# EasyEDA Pro project 二版平衡车pcb.epro, schematic Schematic1
Create Date: 2024-06-18; Page Name: P1; Project Name: 平衡车; Schematic Name: Schematic1; Update Date: 2024-07-03; Company: 嘉立创EDA; Page Size: A4; Version: V1.0
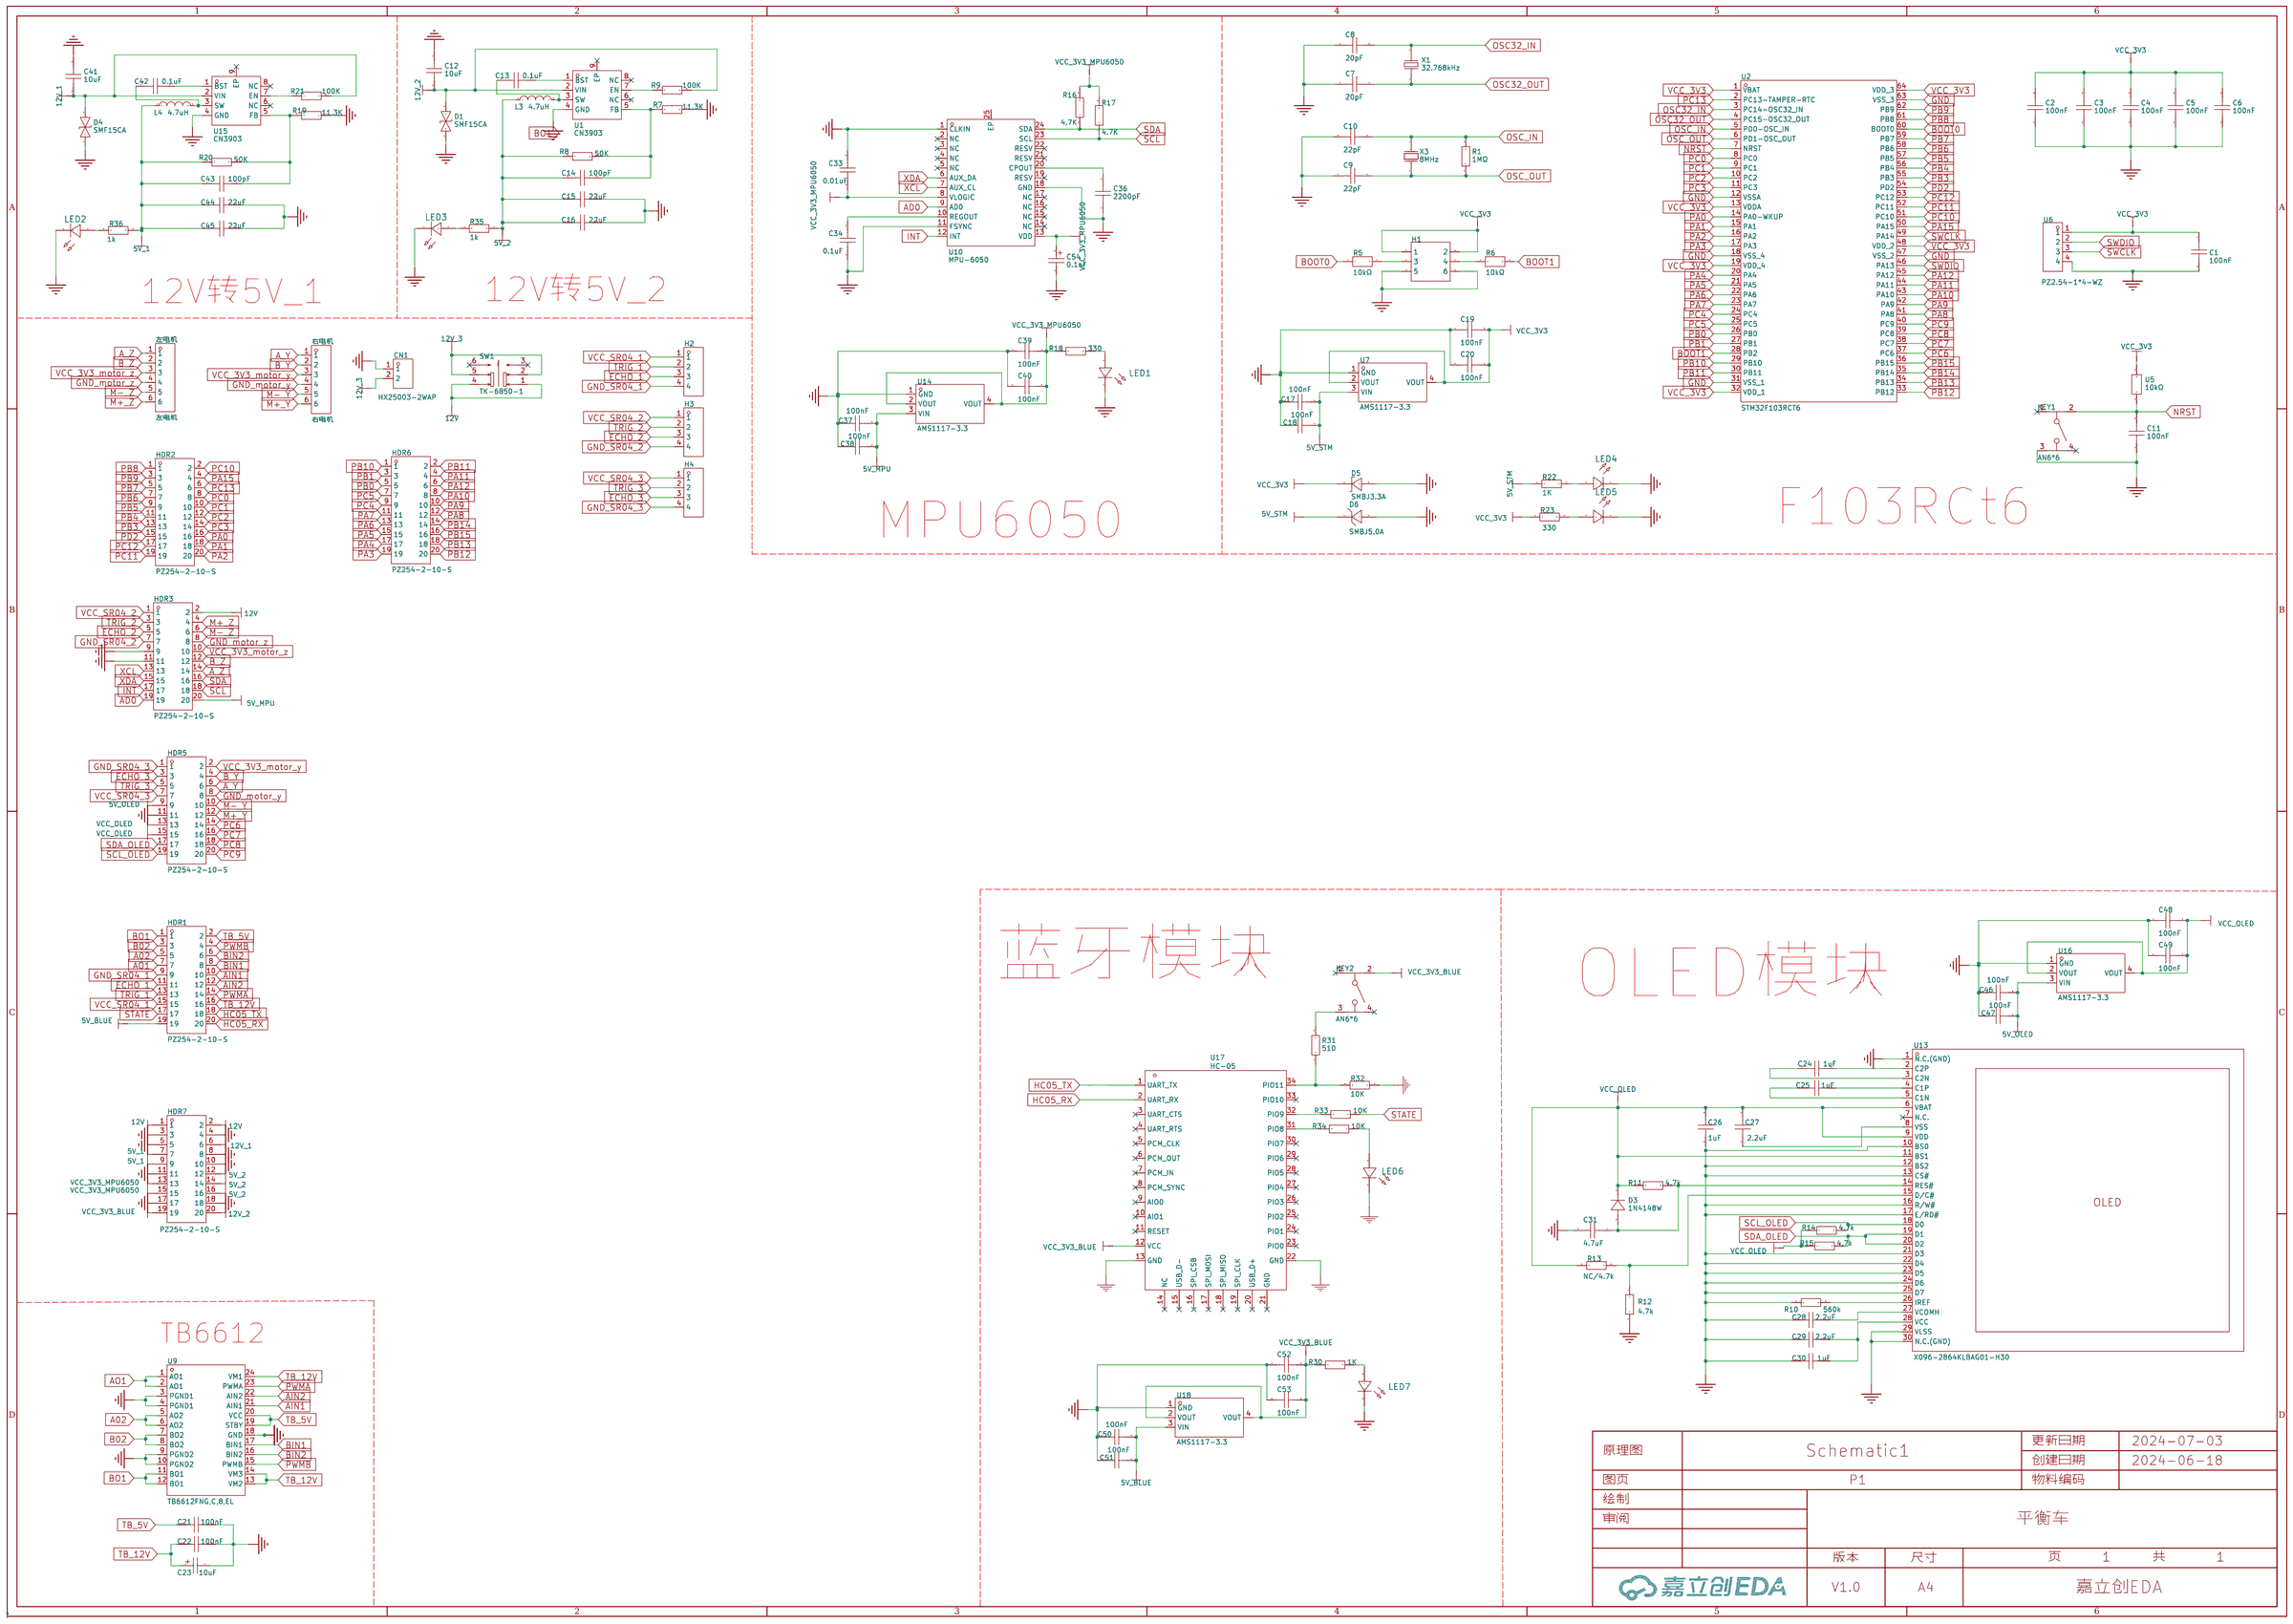
[diagram p0: schematic sheet]

## Parts
C1  100nF  [C0603]
C2  100nF  [C0603]
C3  100nF  [C0603]
C4  100nF  [C0603]
C5  100nF  [C0603]
C6  100nF  [C0603]
C7  20pF  [C0603]
C8  20pF  [C0603]
C9  22pF  [C0603]
C10  22pF  [C0603]
C11  100nF  [C0603]
C12  10uF  [C0603]
C13  0.1uF  [C0603]
C14  100pF  [C0603]
C15  22uF  [C0603]
C16  22uF  [C0603]
C17  100nF  [C0603]
C18  100nF  [C0603]
C19  100nF  [C0603]
C20  100nF  [C0603]
C21  100nF  [C0603]
C22  100nF  [C0603]
C23  10uF  [CASE-B_3528]
C24  1uF  [C0603]
C25  1uF  [C0603]
C26  1uF  [C0603]
C27  2.2uF  [C0603]
C28  2.2uF  [C0603]
C29  2.2uF  [C0603]
C30  1uF  [C0603]
C31  4.7uF  [C0603]
C33  0.01uF  [C0603]
C34  0.1uF  [C0603]
C36  2200pF  [C0603]
C37  100nF  [C0603]
C38  100nF  [C0603]
C39  100nF  [C0603]
C40  100nF  [C0603]
C41  10uF  [C0603]
C42  0.1uF  [C0603]
C43  100pF  [C0603]
C44  22uF  [C0603]
C45  22uF  [C0603]
C46  100nF  [C0603]
C47  100nF  [C0603]
C48  100nF  [C0603]
C49  100nF  [C0603]
C50  100nF  [C0603]
C51  100nF  [C0603]
C52  100nF  [C0603]
C53  100nF  [C0603]
C54  0.1uF  [CASE-B_3528]
CN1  HX25003-2WAP  [CONN-TH_2P-P2.50_HX25003-2WAP]
D1  SMF15CA  [SOD-123FL_L2.8-W1.8-LS3.7-BI]
D3  1N4148W  [SOD-123_L2.8-W1.8-LS3.7-RD-1]
D4  SMF15CA  [SOD-123FL_L2.8-W1.8-LS3.7-BI]
D5  SMBJ3.3A  [SMB_L4.6-W3.6-LS5.3-RD]
D6  SMBJ5.0A  [SMB_L4.6-W3.6-LS5.3-RD]
H1  -  [HDR-TH_6P-P2.54-V-R2-C3-S2.54_A2541WV-2X3P]
H2  -  [HDR-TH_4P-P2.54-V-F]
H3  -  [HDR-TH_4P-P2.54-V-F]
H4  -  [HDR-TH_4P-P2.54-V-F]
HDR1  PZ254-2-10-S  [HDR-SMD_20P-P2.54-V-M-R2-C10-S7.4]
HDR2  PZ254-2-10-S  [HDR-SMD_20P-P2.54-V-M-R2-C10-S7.4]
HDR3  PZ254-2-10-S  [HDR-SMD_20P-P2.54-V-M-R2-C10-S7.4]
HDR5  PZ254-2-10-S  [HDR-SMD_20P-P2.54-V-M-R2-C10-S7.4]
HDR6  PZ254-2-10-S  [HDR-SMD_20P-P2.54-V-M-R2-C10-S7.4]
HDR7  PZ254-2-10-S  [HDR-SMD_20P-P2.54-V-M-R2-C10-S7.4]
KEY1  AN6*6  [KEY-TH_4P-L6.0-W6.0-P6.50-LS4.5]
KEY2  AN6*6  [KEY-TH_4P-L6.0-W6.0-P6.50-LS4.5]
L3  4.7uH  [IND-SMD_L7.3-W6.6]
L4  4.7uH  [IND-SMD_L7.3-W6.6]
LED1  -  [LED_0603]
LED2  -  [LED_0603]
LED3  -  [LED_0603]
LED4  -  [LED_0603]
LED5  -  [LED_0603]
LED6  -  [LED_0603]
LED7  -  [LED_0603]
R1  1MΩ  [R0603]
R5  10kΩ  [R0603]
R6  10kΩ  [R0603]
R7  11.3K  [R0603]
R8  50K  [R0603]
R9  100K  [R0603]
R10  560k  [R0603]
R11  4.7k  [R0603]
R12  4.7k  [R0603]
R13  NC/4.7k  [R0603]
R14  4.7k  [R0603]
R15  4.7k  [R0603]
R16  4.7K  [R0603]
R17  4.7K  [R0603]
R18  330  [R0603]
R19  11.3K  [R0603]
R20  50K  [R0603]
R21  100K  [R0603]
R22  1K  [R0603]
R23  330  [R0603]
R30  1K  [R0603]
R31  510  [R0603]
R32  10K  [R0603]
R33  10K  [R0603]
R34  10K  [R0603]
R35  1k  [R0603]
R36  1k  [R0603]
SW1  TK-6850-1  [SW-TH_TK-6850-1]
U1  CN3903  [ESOP-8_L4.9-W3.9-P1.27-LS6.0-BL-EP-1]
U2  STM32F103RCT6  [LQFP-64_L10.0-W10.0-P0.50-LS12.0-BL]
U5  10kΩ  [R0603]
U6  PZ2.54-1*4-WZ  [HDR-TH_4P-P2.54-H-M-W7.7-P]
U7  AMS1117-3.3  [SOT-223-3_L6.5-W3.4-P2.30-LS7.0-BR]
U9  TB6612FNG,C,8,EL  [SSOP-24_L8.3-W5.6-P0.65-LS7.6-BL]
U10  MPU-6050  [QFN-24_L4.0-W4.0-P0.50-BL-EP2.7]
U13  X096-2864KLBAG01-H30  [OLED-SMD_X096-2864KLBAG01-H30]
U14  AMS1117-3.3  [SOT-223-3_L6.5-W3.4-P2.30-LS7.0-BR]
U15  CN3903  [ESOP-8_L4.9-W3.9-P1.27-LS6.0-BL-EP-1]
U16  AMS1117-3.3  [SOT-223-3_L6.5-W3.4-P2.30-LS7.0-BR]
U17  HC-05  [BTK-05]
U18  AMS1117-3.3  [SOT-223-3_L6.5-W3.4-P2.30-LS7.0-BR]
X1  32.768kHz  [FC-135R_L3.2-W1.5]
X3  8MHz  [OSC-TH_L10.0-W4.5-P5.00]
右电机  右电机  [CONN-TH_6P-P2.00_HCTL_HC-HY-6AW]
左电机  左电机  [CONN-TH_6P-P2.00_HCTL_HC-HY-6AW]

## Library data of the parts
C1-C6 = CC0603KRX7R9BB104: 容值:100nF;精度:±10%;额定电压:50V;材质(温度系数):X7R;; LCSC Part Name: 100nF ±10% 50V; Supplier Part: C14663; Manufacturer: YAGEO(国巨); Supplier Footprint: 0603; JLCPCB Part Class: 基础库; Datasheet: https://atta.szlcsc.com/upload/public/pdf/source/20180910/C282072_33301C7F631E79921B82A8DAC6BCC5B3.pdf; Supplier: LCSC; Tolerance: ±10%; Voltage Rated: 50V; Temperature Coefficient: X7R
C7-C10 = 0603CG200J500NT: 容值:20pF;精度:±5%;额定电压:50V;材质(温度系数):C0G;; LCSC Part Name: 20pF ±5% 50V; Supplier Part: C91702; Manufacturer: FH(风华); Supplier Footprint: 0603; Datasheet: https://atta.szlcsc.com/upload/public/pdf/source/20200305/C486355_26A10D38EF8C2A5C37091D0039909270.pdf; Supplier: LCSC; Tolerance: ±5%; Voltage Rated: 50V; Temperature Coefficient: C0G
C11-C22 C24-C31 C33 C34 C36-C53 = CAP_0603: Supplier Footprint: 0603
C23 C54 = TAJB106K016RNJ: 容值:10uF;精度:±10%;额定电压:16V;等效串联电阻:2.8Ω@100kHz;; LCSC Part Name: 10uF ±10% 16V; Supplier Part: C7193; Manufacturer: Kyocera AVX; Supplier Footprint: CASE-B-3528; JLCPCB Part Class: Extended Part; Datasheet: https://atta.szlcsc.com/upload/public/pdf/source/20160107/1457707750344.pdf; Supplier: LCSC; Tolerance: ±10%; Rated Voltage: 16V; Equivalent Series Resistance(ESR): 2.8Ω@100kHz; Operating Temperature: -55℃~+125℃
CN1 = HX25003-2WAP: 插针结构:1x2P;间距:2.5mm;安装方式:弯插;参考系列:XH;总PIN数:2P;排数:1;每排PIN数:2;行距:-;额定电流:-;工作温度范围:-;; LCSC Part Name: 1x2P 间距:2.5mm 弯插 系列:XH; Supplier Part: C442326; Manufacturer: HX(红星); Supplier Footprint: 弯插,P=2.5mm; JLCPCB Part Class: 扩展库; Datasheet: https://atta.szlcsc.com/upload/public/pdf/source/20191028/C442341_CB026E8ECE589085FA4A025D9CD8B44B.pdf; Supplier: LCSC; Pins Structure: 1x2P; Pitch: 2.5mm; Mounting Style: 弯插; Reference Series: XH; Number of Pins: 2P; Number of Rows: 1; Number of PINs Per Row: 2
D1 D4 = SMF15CA_C5116426: 极性:双向;反向截止电压(Vrwm):15V;最大钳位电压:24.4V;峰值脉冲电流(Ipp)@10/1000us:8.2A;峰值脉冲功率(Ppp)@10/1000us:200W;击穿电压:18.5V;; LCSC Part Name: 瞬态抑制二极管(TVS); Supplier Part: C5116426; Manufacturer: SHIKUES(时科); Supplier Footprint: SOD-123FL; JLCPCB Part Class: 扩展库; Datasheet: https://atta.szlcsc.com/upload/public/pdf/source/20220715/82D6503F9C43F0DF9BB8970EC229759F.pdf; Supplier: LCSC; polarity: 双向; Reverse Stand-Off Voltage (Vrwm): 15V; Maximum Clamping Voltage: 24.4V; Peak Pulse Current (Ipp)@10/1000us: 8.2A; Peak Pulse Power Dissipation (Ppp)@10/1000us: 200W; Breakdown Voltage: 18.5V; Reverse Leakage Current (Ir): 1uA; Type: TVS
D3 = 1N4148W_C917030: 二极管配置:独立式;正向压降(Vf):1.25V@150mA;直流反向耐压(Vr):100V;平均整流电流(Io):300mA;功率:400mW;反向恢复时间(trr):8ns;; LCSC Part Name: 电压:100V 电流:300mA; Supplier Part: C917030; Manufacturer: JSMSEMI(杰盛微); Supplier Footprint: SOD-123; JLCPCB Part Class: 扩展库; Datasheet: https://atta.szlcsc.com/upload/public/pdf/source/20230807/C928F35F082AC22834996B2570733516.pdf; Supplier: LCSC; Diode Configuration: 独立式; Forward Voltage (Vf@If): 1.25V@150mA; Reverse Voltage (Vr): 100V; Average Rectified Current (Io): 300mA; Power Dissipation: 400mW; Reverse Leakage Current: 1uA@75V; Reverse Recovery Time (trr): 8ns; Operating Temperature: -55℃~+150℃@(Tj)
D5 = SMBJ3.3A_C29715: 反向截止电压(Vrwm):3.3V;最大钳位电压:7.2V;峰值脉冲电流(Ipp)@10/1000us:42A;击穿电压:4V;; Supplier Part: C29715; Manufacturer: RUILON(瑞隆源); Supplier Footprint: SMB(DO-214AA); JLCPCB Part Class: 扩展库; Datasheet: https://atta.szlcsc.com/upload/public/pdf/source/20180716/C29715_E6EABBF81195B419C59879CD6F1DD929.pdf; Supplier: LCSC; Reverse Stand-Off Voltage (Vrwm): 3.3V; Maximum Clamping Voltage: 7.2V; Peak Pulse Current (Ipp)@10/1000us: 42A; Breakdown Voltage: 4V; Type: TVS
D6 = SMBJ5.0A_C113974: 反向截止电压(Vrwm):5V;最大钳位电压:9.2V;峰值脉冲电流(Ipp)@10/1000us:65.2A;击穿电压:6.4V;; LCSC Part Name: TVS 5V截止 65.22A峰值脉冲; Supplier Part: C113974; Manufacturer: MDD; Supplier Footprint: SMB(DO-214AA); JLCPCB Part Class: 扩展库; Datasheet: https://atta.szlcsc.com/upload/public/pdf/source/20230314/C8F66EF07395B88C11214ABD10019202.pdf; Supplier: LCSC; Reverse Stand-Off Voltage (Vrwm): 5V; Maximum Clamping Voltage: 9.2V; Peak Pulse Current (Ipp)@10/1000us: 65.2A; Breakdown Voltage: 6.4V; Type: TVS
H1 = HDR-M_2.54_2x3: Supplier Part: C402781; Supplier Footprint: 插件,P=2.54mm
H2-H4 = HDR-F_2.54_1x4P: Supplier Part: C2718488; Supplier Footprint: 插件
HDR1-HDR3 HDR5-HDR7 = PZ254-2-10-S: 插针结构:2x10P;间距:2.54mm;行距:2.54mm;圆针/方针:方针;安装类型:立贴;排数:双排;总PIN位数:20P;额定电流:3A;额定电压:250V;配合针长度:6mm;塑高:2.5mm;端接针长度:-;工作温度范围:-40℃~+105℃;焊接温度(最大值):260℃@5S;颜色:黑色;; LCSC Part Name: 2x10P 间距:2.54mm 方针 立贴 黑色; Supplier Part: C3294468; Manufacturer: HCTL(华灿天禄); Supplier Footprint: SMD,P=2.54mm; JLCPCB Part Class: 扩展库; Datasheet: https://atta.szlcsc.com/upload/public/pdf/source/20230609/FB2B5B924AA338E6CB93C3BD1D012B72.pdf; Supplier: LCSC; Pin Structure: 2x10P; Pitch: 2.54mm; Row Spacing: 2.54mm; Circluar Pins/Square Pins: 方针; Mounting Type: 立贴; Number of Rows: 双排; Number of Pins: 20P; Current Rating (Max): 3A; Voltage Rating (Max): 250V; Length of Mating Pin: 6mm; Insulation Height: 2.5mm; Operating Temperature Range: -40℃~+105℃; Soldering Temperature(Max): 260℃@5S; Color: 黑色
KEY1 KEY2 = AN6*6: Supplier Part: C9900018275; Supplier Footprint: KEY-TH_4P-L6.0-W6.0-P4.50-LS6.50; JLCPCB Part Class: 扩展库; Supplier: LCSC
L3 L4 = MCS0630-4R7MPY1: 电感值:4.7uH;精度:±20%;额定电流:5.5A;饱和电流(Isat):7A;; LCSC Part Name: 4.7uH ±20% 7A; Supplier Part: C2937097; Manufacturer: PSA(信昌电陶); Supplier Footprint: 0630; JLCPCB Part Class: 扩展库; Datasheet: https://atta.szlcsc.com/upload/public/pdf/source/20220121/EA6E6E6F70ED7BAE67EC293805EAAACB.pdf; Supplier: LCSC; Tolerance: ±20%; Rated Current: 5.5A; Saturation Current (Isat): 7A; DC Resistance (DCR): 37mΩ
LED1-LED7 = LED_0603-R: Supplier Footprint: 0603
R1 = RC0603JR-071ML: 电阻类型:厚膜电阻;阻值:1MΩ;精度:±5%;功率:100mW;最大工作电压:75V;温度系数:±100ppm/℃;; LCSC Part Name: 厚膜电阻 1MΩ ±5% 100mW; Supplier Part: C107698; Manufacturer: YAGEO(国巨); Supplier Footprint: 0603; Datasheet: https://atta.szlcsc.com/upload/public/pdf/source/20180316/70C0E2BDAE7FCC62C531A5A58D202EE1.pdf; Supplier: LCSC; Type: 厚膜电阻; Tolerance: ±5%; Power(Watts): 100mW; Overload Voltage (Max): 75V; Temperature Coefficient: ±100ppm/℃; Operating Temperature Range: -55℃~+155℃
R5 R6 U5 = TNPW060310K0BEEN: 电阻类型:薄膜电阻;阻值:10kΩ;精度:±0.1%;功率:125mW;温度系数:±25ppm/℃;; LCSC Part Name: 薄膜电阻 10kΩ ±0.1% 125mW; Supplier Part: C2073762; Manufacturer: VISHAY(威世); Supplier Footprint: 0603; JLCPCB Part Class: 扩展库; Datasheet: https://atta.szlcsc.com/upload/public/pdf/source/20210611/7E5076F8AE36443BBEA8C2F8BE3882EA.pdf; Supplier: LCSC; Type: 薄膜电阻; Tolerance: ±0.1%; Power(Watts): 125mW; Temperature Coefficient: ±25ppm/℃; Operating Temperature Range: -55℃~+155℃
R7-R23 R30-R36 = Res_0603: Supplier Footprint: 0603
SW1 = TK-6850-1: 电路结构:双刀双掷;自锁/无锁:自锁;安装方式:直插;作用力:240gf;机械寿命:-;; LCSC Part Name: 自锁开关8.5*8.5*13.8有声有锁高导高柄插件双排6P按键开关带锁DIP六脚; Supplier Part: C528790; Manufacturer: Yuandi(元迪); Supplier Footprint: 插件; JLCPCB Part Class: 扩展库; Datasheet: https://atta.szlcsc.com/upload/public/pdf/source/20200831/C528790_5A71F76A4E28AAB920786EBE54029283.pdf; Supplier: LCSC; Circuit: 双刀双掷; Self Lock / No Lock: 自锁; Actuator Style: 矩形柱塞; Mounting Style: 直插; Actuator/Cap Color: 白色; Pin Style: PC引脚; Operating Force: 240gf
U1 U15 = CN3903: Supplier Part: C9900019476; Supplier Footprint: ESOP-8; JLCPCB Part Class: 扩展库; Supplier: LCSC
U2 = STM32F103RCT6: CPU内核:CM3;程序存储容量:256KB;RAM总容量:48KB;GPIO端口数量:51;工作电压范围:2V~3.6V;CPU最大主频:72MHz;程序存储器类型:FLASH;; Supplier Part: C8323; Manufacturer: ST(意法半导体); Supplier Footprint: LQFP-64(10x10); JLCPCB Part Class: 扩展库; Datasheet: https://atta.szlcsc.com/upload/public/pdf/source/20180207/C88442_15179953708671359491.pdf; Supplier: LCSC; CPU Core: CM3; Program Storage Size: 256KB; RAM Size: 48KB; GPIO Ports Number: 51; Operating Voltage Range: 2V~3.6V; CPU Maximum Speed: 72MHz; Program Memory Type: FLASH; Operating Temperature Range: -40℃~+85℃; ADC (Bit): 12bit; DAC (Bit): 12bit; Universal Serial Bus: 有; Peripheral/Function: DMA；片载温度传感器；PWM; Watchdog: 有; Infrared Data Association: 有; Low-Voltage Detect: 有; Direct Memory Access: 有; Internal Oscillator: 有
U6 = PZ2.54-1*4-WZ: 插针结构:1x4P;间距:2.54mm;安装类型:弯插;排数:单排;总PIN位数:4P;触头镀层:金;; Supplier Part: C5224015; Manufacturer: ZHOURI(洲日); Supplier Footprint: 弯插,P=2.54mm; JLCPCB Part Class: 扩展库; Datasheet: https://atta.szlcsc.com/upload/public/pdf/source/20221031/5E07F614DEAC37F80EB82945E6A3298C.pdf; Supplier: LCSC; Pin Structure: 1x4P; Pitch: 2.54mm; Mounting Type: 弯插; Number of Rows: 单排; Number of Pins: 4P; Contact Plating: 金
U7 U14 U16 U18 = AMS1117-3.3_C6186: 输出类型:固定;最大输入电压:-;输出电压:3.3V;最大输出电流:1A;电源纹波抑制比(PSRR):72dB@(120Hz);输出极性:正极;; LCSC Part Name: 输出3.3V 1A; Supplier Part: C6186; Manufacturer: AMS; Supplier Footprint: SOT-223; JLCPCB Part Class: Basic Part; Datasheet: https://atta.szlcsc.com/upload/public/pdf/source/20180727/C6186_7A095716F0823C02F1997A905E26C086.pdf; Supplier: LCSC; Output Type: 固定; Output Voltage: 3.3V; MAX Output Current: 1A; Power Supply Rejection Ratio (PSRR): 72dB@(120Hz); Dropout Voltage: 1.3V@(800mA); Output Polarity: 正极; Number of Outputs: 1
U9 = TB6612FNG,C,8,EL: 驱动电机类型:有刷直流电机;电源电压:2.7V~5.5V;输出电流:1A;接口:并行;; LCSC Part Name: 1A 有刷直流电机驱动芯片 5.5V; Supplier Part: C141517; Manufacturer: TOSHIBA(东芝); Supplier Footprint: SSOP-24; JLCPCB Part Class: 扩展库; Datasheet: https://atta.szlcsc.com/upload/public/pdf/source/20171128/C141517_15118625624231147036.pdf; Supplier: LCSC; Drive motor type: 有刷直流电机; Supply Voltage: 2.7V~5.5V; Output Current: 1A; Interface: 并行; Operating Temperature: -20℃~+85℃@(Ta)
U10 = MPU-6050: 传感器类型:加速度计陀螺仪;; Supplier Part: C24112; Manufacturer: TDK InvenSense(应美盛); Supplier Footprint: QFN-24-EP(4x4); JLCPCB Part Class: 扩展库; Datasheet: https://atta.szlcsc.com/upload/public/pdf/source/20140425/1457707046159.pdf; Supplier: LCSC; Sensor Type: 加速度计陀螺仪; Operating Temperature: -40℃~+85℃
U13 = X096-2864KLBAG01-H30: 主控芯片:SSD1315;尺寸(inch):0.96;像素分辨率:128x64;; LCSC Part Name: 0.96寸 蓝光 128x64像素分辨率 30PIN; Supplier Part: C4944144; Manufacturer: Newvision(新智景); JLCPCB Part Class: Extended Part; Datasheet: https://atta.szlcsc.com/upload/public/pdf/source/20220811/AFF42A01440844B6AF7EF5D26E15DF13.pdf; Supplier: LCSC; Main Control Chip: SSD1315; Size: 0.96; Pixel Resolution: 128x64; Operating Temperature: -40℃~+85℃
U17 = HC-05
X1 = Q13FC13500004_C32346: 晶振类型:贴片晶振;频率:32.768kHz;常温频差:±20ppm;外接负载电容:12.5pF;; LCSC Part Name: 32.768kHz ±20ppm 12.5pF; Supplier Part: C32346; Manufacturer: EPSON(爱普生); Manufacturer Part: Q13FC13500004; Supplier Footprint: SMD3215-2P; JLCPCB Part Class: 基础库; Datasheet: https://atta.szlcsc.com/upload/public/pdf/source/20240418/0E0FF5F0356BA3753F616001439D1416.pdf; Supplier: LCSC; Crystal Type: 贴片晶振; Normal temperature Frequency Tolerance: ±20ppm; External load capacitor: 12.5pF; Equivalent Series Resistance (ESR): 70kΩ; Operating Temperature: -40℃~+85℃
X3 = X49SD8MSD2SC: 晶振类型:直插晶振;频率:8MHz;常温频差:±20ppm;外接负载电容:20pF;频率稳定度(全温):±30ppm;; LCSC Part Name: 8MHz ±20ppm 20pF; Supplier Part: C21263; Manufacturer: YXC(扬兴晶振); Supplier Footprint: HC-49S; JLCPCB Part Class: 扩展库; Datasheet: https://atta.szlcsc.com/upload/public/pdf/source/20210903/A997D130AE99CBB55D9024F9BE6DA174.pdf; Supplier: LCSC; Crystal Type: 直插晶振; Normal temperature Frequency Tolerance: ±20ppm; External load capacitor: 20pF; Frequency Stability(Full temperature range): ±30ppm; Operating Temperature: -20℃~+70℃
右电机 左电机 = HC-HY-6AW: 插针结构:1x6P;间距:2mm;安装方式:弯插;参考系列:-;总PIN数:6P;排数:1;每排PIN数:6;行距:-;额定电流:2A;触头材质:黄铜;触头镀层:锡;工作温度范围:-25℃~+85℃;; LCSC Part Name: 1x6P 间距:2mm 弯插; Supplier Part: C2845479; Manufacturer: HCTL(华灿天禄); Supplier Footprint: 弯插,P=2mm; JLCPCB Part Class: 扩展库; Datasheet: https://atta.szlcsc.com/upload/public/pdf/source/20231019/1D69C701C8B5913AD82CF3DFD72C7042.pdf; Supplier: LCSC; Pins Structure: 1x6P; Pitch: 2mm; Mounting Style: 弯插; Number of Pins: 6P; Number of Rows: 1; Number of PINs Per Row: 6; Current Rating (Max): 2A; Contact Material: 黄铜; Contact Plating: 锡; Operating Temperature Range: -25℃~+85℃

## Nets
5V_1: C43.1 C44.1 C45.1 HDR7.7 HDR7.9 L4.1 R20.1 R36.2
5V_2: C14.1 C15.1 C16.1 HDR7.12 HDR7.14 HDR7.16 L3.1 R8.1 R35.2
5V_BLUE: C50.2 C51.2 HDR1.19 U18.3(VIN)
5V_MPU: C37.2 C38.2 HDR3.20 U14.3(VIN)
5V_OLED: C46.2 C47.2 HDR5.9 U16.3(VIN)
5V_STM: C17.2 C18.2 D6.1(C) R22.1 U7.3(VIN)
12V: HDR3.2 HDR7.1 HDR7.2 SW1.1 SW1.4
12V_1: C41.2 D4.2 HDR7.6 R21.2 U15.2(VIN)
12V_2: C12.2 D1.2 HDR7.20 R9.2 U1.2(VIN)
12V_3: CN1.2 SW1.2 SW1.5
GND: C1.2 C2.1 C3.1 C4.1 C5.1 C6.1 C7.1 C8.1 C9.2 C10.2 C11.1 C12.1 C15.2 C16.2 C17.1 C18.1 C19.1 C20.1 C21.2 C22.2 C23.2 C26.1 C28.2 C29.2 C30.1 C31.2 C33.2 C34.1 C36.1 C37.1 C38.1 C39.1 C40.1 C41.1 C44.2 C45.2 C46.1 C47.1 C48.1 C49.1 C50.1 C51.1 C52.1 C53.1 C54.2 CN1.1 D1.1 D4.1 D5.2(A) D6.2(A) H1.5 H1.6 HDR3.9 HDR3.11 HDR5.11 HDR7.3 HDR7.4 HDR7.5 HDR7.8 HDR7.10 HDR7.11 HDR7.17 HDR7.18 KEY1.3 LED1.1(C) LED2.1(C) LED3.1(C) LED4.1(C) LED5.1(C) LED6.1(C) LED7.1(C) R7.1 R10.1 R12.2 R19.1 R32.1 U1.4(GND) U2.12(VSSA) U2.18(VSS_4) U2.31(VSS_1) U2.47(VSS_2) U2.63(VSS_3) U6.4 U7.1(GND) U9.3(PGND1) U9.4(PGND1) U9.9(PGND2) U9.10(PGND2) U9.18(GND) U10.1(CLKIN) U10.11(FSYNC) U10.18(GND) U13.1(N.C.(GND)) U13.10(BS0) U13.12(BS2) U13.13(CS#) U13.16(R/W#) U13.17(E/RD#) U13.21(D3) U13.22(D4) U13.23(D5) U13.24(D6) U13.25(D7) U13.29(VLSS) U13.30(N.C.(GND)) U14.1(GND) U15.4(GND) U16.1(GND) U17.13(GND) U17.22(GND) U18.1(GND)
GND_motor_y: HDR5.8 右电机.4
GND_motor_z: HDR3.8 左电机.4
GND_SR04_1: H2.4 HDR1.9
GND_SR04_2: H3.4 HDR3.7
GND_SR04_3: H4.4 HDR5.1
VCC_3V3: C1.1 C2.2 C3.2 C4.2 C5.2 C6.2 C19.2 C20.2 D5.1(K) H1.1 H1.2 R23.1 U2.1(VBAT) U2.13(VDDA) U2.19(VDD_4) U2.32(VDD_1) U2.48(VDD_2) U2.64(VDD_3) U5.2 U6.1 U7.2(VOUT) U7.4(VOUT)
VCC_3V3_BLUE: C52.2 C53.2 HDR7.19 KEY2.2 R30.1 U17.12(VCC) U18.2(VOUT) U18.4(VOUT)
VCC_3V3_motor_y: HDR5.2 右电机.3
VCC_3V3_motor_z: HDR3.10 左电机.3
VCC_3V3_MPU6050: C33.1 C39.2 C40.2 C54.1 HDR7.13 HDR7.15 R16.2 R17.2 R18.1 U10.8(VLOGIC) U10.13(VDD) U14.2(VOUT) U14.4(VOUT)
VCC_OLED: C26.2 C27.2 C48.2 C49.2 D3.1(C) HDR5.13 HDR5.15 R11.2 R13.1 R14.2 R15.2 U13.6(VBAT) U13.9(VDD) U13.11(BS1) U16.2(VOUT) U16.4(VOUT)
VCC_SR04_1: H2.1 HDR1.15
VCC_SR04_2: H3.1 HDR3.1
VCC_SR04_3: H4.1 HDR5.7
A02: HDR1.5 U9.5(AO2) U9.6(AO2)
A_Y: HDR5.6 右电机.1
A_Z: HDR3.14 左电机.1
AD0: HDR3.19 U10.9(AD0)
AIN1: HDR1.10 U9.21(AIN1)
AIN2: HDR1.12 U9.22(AIN2)
AO1: HDR1.7 U9.1(AO1) U9.2(AO1)
B02: HDR1.3 U9.7(BO2) U9.8(BO2)
B_Y: HDR5.4 右电机.2
B_Z: HDR3.12 左电机.2
BIN1: HDR1.8 U9.17(BIN1)
BIN2: HDR1.6 U9.16(BIN2)
BO1: HDR1.1 U9.11(BO1) U9.12(BO1)
BOOT0: R5.1 U2.60(BOOT0)
BOOT1: R6.2 U2.28(PB2)
ECHO_1: H2.3 HDR1.11
ECHO_2: H3.3 HDR3.5
ECHO_3: H4.3 HDR5.3
HC05_RX: HDR1.20 U17.2(UART_RX)
HC05_TX: HDR1.18 U17.1(UART_TX)
INT: HDR3.17 U10.12(INT)
M+_Y: HDR5.12 右电机.6
M+_Z: HDR3.4 左电机.6
M-_Y: HDR5.10 右电机.5
M-_Z: HDR3.6 左电机.5
NRST: C11.2 KEY1.2 U2.7(NRST) U5.1
OSC32_IN: C8.2 U2.3(PC14-OSC32_IN) X1.2
OSC32_OUT: C7.2 U2.4(PC15-OSC32_OUT) X1.1
OSC_IN: C10.1 R1.2 U2.5(PD0-OSC_IN) X3.1(OSC1)
OSC_OUT: C9.1 R1.1 U2.6(PD1-OSC_OUT) X3.2(OSC2)
PA0: HDR2.16 U2.14(PA0-WKUP)
PA1: HDR2.18 U2.15(PA1)
PA2: HDR2.20 U2.16(PA2)
PA3: HDR6.19 U2.17(PA3)
PA4: HDR6.17 U2.20(PA4)
PA5: HDR6.15 U2.21(PA5)
PA6: HDR6.13 U2.22(PA6)
PA7: HDR6.11 U2.23(PA7)
PA8: HDR6.12 U2.41(PA8)
PA9: HDR6.10 U2.42(PA9)
PA10: HDR6.8 U2.43(PA10)
PA11: HDR6.4 U2.44(PA11)
PA12: HDR6.6 U2.45(PA12)
PA15: HDR2.4 U2.50(PA15)
PB0: HDR6.5 U2.26(PB0)
PB1: HDR6.3 U2.27(PB1)
PB3: HDR2.13 U2.55(PB3)
PB4: HDR2.11 U2.56(PB4)
PB5: HDR2.9 U2.57(PB5)
PB6: HDR2.7 U2.58(PB6)
PB7: HDR2.5 U2.59(PB7)
PB8: HDR2.1 U2.61(PB8)
PB9: HDR2.3 U2.62(PB9)
PB10: HDR6.1 U2.29(PB10)
PB11: HDR6.2 U2.30(PB11)
PB12: HDR6.20 U2.33(PB12)
PB13: HDR6.18 U2.34(PB13)
PB14: HDR6.14 U2.35(PB14)
PB15: HDR6.16 U2.36(PB15)
PC0: HDR2.8 U2.8(PC0)
PC1: HDR2.10 U2.9(PC1)
PC2: HDR2.12 U2.10(PC2)
PC3: HDR2.14 U2.11(PC3)
PC4: HDR6.9 U2.24(PC4)
PC5: HDR6.7 U2.25(PC5)
PC6: HDR5.14 U2.37(PC6)
PC7: HDR5.16 U2.38(PC7)
PC8: HDR5.18 U2.39(PC8)
PC9: HDR5.20 U2.40(PC9)
PC10: HDR2.2 U2.51(PC10)
PC11: HDR2.19 U2.52(PC11)
PC12: HDR2.17 U2.53(PC12)
PC13: HDR2.6 U2.2(PC13-TAMPER-RTC)
PD2: HDR2.15 U2.54(PD2)
PWMA: HDR1.14 U9.23(PWMA)
PWMB: HDR1.4 U9.15(PWMB)
SCL: HDR3.18 R17.1 U10.23(SCL)
SCL_OLED: HDR5.19 R14.1 U13.18(D0)
SDA: HDR3.16 R16.1 U10.24(SDA)
SDA_OLED: HDR5.17 R15.1 U13.19(D1) U13.20(D2)
STATE: HDR1.17 R33.1
SWCLK: U2.49(PA14) U6.3
SWDIO: U2.46(PA13) U6.2
TB_5V: C21.1 HDR1.2 U9.19(STBY) U9.20(VCC)
TB_12V: C22.1 C23.1 HDR1.16 U9.13(VM2) U9.14(VM3) U9.24(VM1)
TRIG_1: H2.2 HDR1.13
TRIG_2: H3.2 HDR3.3
TRIG_3: H4.2 HDR5.5
XCL: HDR3.13 U10.7(AUX_CL)
XDA: HDR3.15 U10.6(AUX_DA)
$1N3226: H1.3 R5.2
$1N3227: H1.4 R6.1
$1N3962: C13.1 U1.1(BST)
$1N3965: C13.2 L3.2 U1.3(SW)
$1N4279: C14.2 R7.2 R8.2 U1.5(FB)
$1N4478: R9.1 U1.7(EN)
$1N13670: C24.2 U13.2(C2P)
$1N13682: C24.1 U13.3(C2N)
$1N13715: C25.2 U13.4(C1P)
$1N13718: C25.1 U13.5(C1N)
$1N13876: C27.1 U13.8(VSS)
$1N14383: R10.2 U13.26(IREF)
$1N14540: C28.1 U13.27(VCOMH)
$1N14626: C29.1 C30.2 U13.28(VCC)
$1N15088: C31.1 D3.2(A) R11.1 U13.14(RES#)
$1N15283: R12.1 R13.2 U13.15(D/C#)
$1N23291: C34.2 U10.10(REGOUT)
$1N23685: C36.2 U10.20(CPOUT)
$1N26246: LED1.2(A) R18.2
$1N26808: C42.1 U15.1(BST)
$1N26809: C42.2 L4.2 U15.3(SW)
$1N26811: C43.2 R19.2 R20.2 U15.5(FB)
$1N26814: R21.1 U15.7(EN)
$1N32704: LED4.2(A) R22.2
$1N32715: LED5.2(A) R23.2
$1N33702: LED7.2(A) R30.2
$1N34229: KEY2.3 R31.2
$1N34236: R31.1 R32.2 U17.34(PIO11)
$1N34289: R33.2 U17.32(PIO9)
$1N34387: R34.2 U17.31(PIO8)
$1N34392: LED6.2(A) R34.1
$1N34524: LED2.2(A) R36.1
$1N34558: LED3.2(A) R35.1

Not connected (* = marked no-connect by the designer): KEY1 1* 4*; KEY2 1* 4*; SW1 3* 6*; U1 6(NC)* 8(NC)* 9(EP)*; U10 2(NC)* 3(NC)* 4(NC)* 5(NC)* 14(NC)* 15(NC)* 16(NC)* 17(NC)* 19(RESV)* 21(RESV)* 22(RESV)* 25(EP); U13 7(N.C.)*; U15 6(NC)* 8(NC)* 9(EP)*; U17 3(UART_CTS)* 4(UART_RTS)* 5(PCM_CLK)* 6(PCM_OUT)* 7(PCM_IN)* 8(PCM_SYNC)* 9(AIO0)* 10(AIO1)* 11(RESET)* 14(NC)* 15(USB_D-)* 16(SPI_CSB)* 17(SPI_MOSI)* 18(SPI_MISO)* 19(SPI_CLK)* 20(USB_D+)* 21(GND)* 23(PIO0)* 24(PIO1)* 25(PIO2)* 26(PIO3)* 27(PIO4)* 28(PIO5)* 29(PIO6)* 30(PIO7)* 33(PIO10)*

## Notes on the sheet
- 12V转5V_1
- 12V转5V_2
- F103RCt6
- MPU6050
- 蓝牙模块
- OLED模块
- TB6612
